# Altium schematic sheet Top_Level.SchDoc: AusBubble : Logic & RF : Top Level
size A4; DrawnBy: WR, ND; DocumentNumber: 1; Revision: A; SheetNumber: 1; SheetTotal: 5
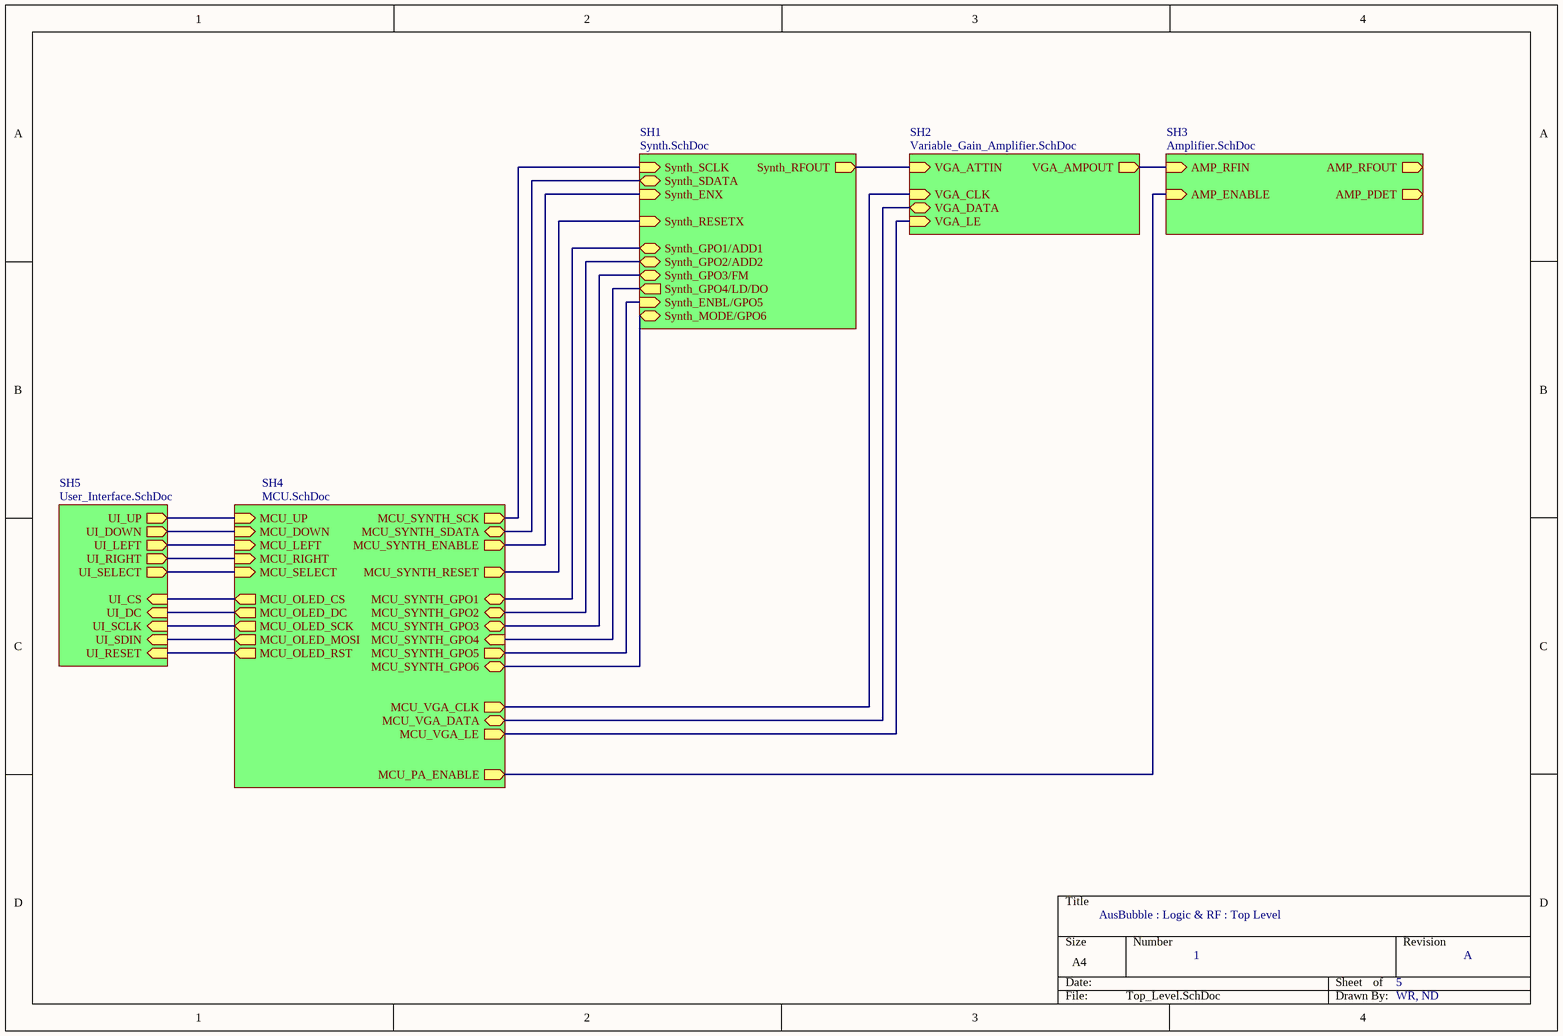
[diagram p0: Top_Level.SchDoc]

## Sub-sheets
SH1 = Synth.SchDoc: Synth_RESETX (in), Synth_ENX (in), Synth_SCLK (in), Synth_SDATA, Synth_ENBL/GPO5 (in), Synth_GPO4/LD/DO (out), Synth_RFOUT (out), Synth_GPO3/FM (bidir), Synth_GPO1/ADD1 (bidir), Synth_GPO2/ADD2 (bidir), Synth_MODE/GPO6 (bidir)
SH2 = Variable_Gain_Amplifier.SchDoc: VGA_AMPOUT (out), VGA_CLK (in), VGA_DATA (bidir), VGA_LE (in), VGA_ATTIN (in)
SH3 = Amplifier.SchDoc: AMP_RFIN (in), AMP_RFOUT (out), AMP_ENABLE (in), AMP_PDET (out)
SH4 = MCU.SchDoc: MCU_UP (in), MCU_DOWN (in), MCU_LEFT (in), MCU_RIGHT (in), MCU_SELECT (in), MCU_PA_ENABLE (out), MCU_OLED_CS (out), MCU_OLED_DC (out), MCU_OLED_RST (out), MCU_OLED_SCK (out), MCU_OLED_MOSI (out), MCU_VGA_LE (out), MCU_VGA_DATA (bidir), MCU_VGA_CLK (out), MCU_SYNTH_GPO4 (in), MCU_SYNTH_GPO3 (bidir), MCU_SYNTH_GPO2 (bidir), MCU_SYNTH_GPO1 (bidir), MCU_SYNTH_ENABLE (out), MCU_SYNTH_RESET (out), MCU_SYNTH_SDATA, MCU_SYNTH_SCK (out), MCU_SYNTH_GPO5 (out), MCU_SYNTH_GPO6 (bidir)
SH5 = User_Interface.SchDoc: UI_CS (in), UI_DC (in), UI_SCLK (in), UI_SDIN (in), UI_RESET (in), UI_UP (out), UI_DOWN (out), UI_LEFT (out), UI_RIGHT (out), UI_SELECT (out)

## Nets
(unnamed): sheet SH1/Synth_RESETX, sheet SH4/MCU_SYNTH_RESET
(unnamed): sheet SH1/Synth_ENX, sheet SH4/MCU_SYNTH_ENABLE
(unnamed): sheet SH1/Synth_SCLK, sheet SH4/MCU_SYNTH_SCK
(unnamed): sheet SH1/Synth_SDATA, sheet SH4/MCU_SYNTH_SDATA
(unnamed): sheet SH1/Synth_ENBL/GPO5, sheet SH4/MCU_SYNTH_GPO5
(unnamed): sheet SH1/Synth_GPO4/LD/DO, sheet SH4/MCU_SYNTH_GPO4
(unnamed): sheet SH1/Synth_RFOUT, sheet SH2/VGA_ATTIN
(unnamed): sheet SH1/Synth_GPO3/FM, sheet SH4/MCU_SYNTH_GPO3
(unnamed): sheet SH1/Synth_GPO1/ADD1, sheet SH4/MCU_SYNTH_GPO1
(unnamed): sheet SH1/Synth_GPO2/ADD2, sheet SH4/MCU_SYNTH_GPO2
(unnamed): sheet SH1/Synth_MODE/GPO6, sheet SH4/MCU_SYNTH_GPO6
(unnamed): sheet SH2/VGA_AMPOUT, sheet SH3/AMP_RFIN
(unnamed): sheet SH2/VGA_CLK, sheet SH4/MCU_VGA_CLK
(unnamed): sheet SH2/VGA_DATA, sheet SH4/MCU_VGA_DATA
(unnamed): sheet SH2/VGA_LE, sheet SH4/MCU_VGA_LE
(unnamed): sheet SH3/AMP_ENABLE, sheet SH4/MCU_PA_ENABLE
(unnamed): sheet SH4/MCU_UP, sheet SH5/UI_UP
(unnamed): sheet SH4/MCU_DOWN, sheet SH5/UI_DOWN
(unnamed): sheet SH4/MCU_LEFT, sheet SH5/UI_LEFT
(unnamed): sheet SH4/MCU_RIGHT, sheet SH5/UI_RIGHT
(unnamed): sheet SH4/MCU_SELECT, sheet SH5/UI_SELECT
(unnamed): sheet SH4/MCU_OLED_CS, sheet SH5/UI_CS
(unnamed): sheet SH4/MCU_OLED_DC, sheet SH5/UI_DC
(unnamed): sheet SH4/MCU_OLED_RST, sheet SH5/UI_RESET
(unnamed): sheet SH4/MCU_OLED_SCK, sheet SH5/UI_SCLK
(unnamed): sheet SH4/MCU_OLED_MOSI, sheet SH5/UI_SDIN